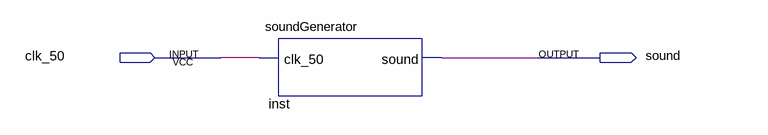
[diagram p0: schematic sheet]
// Quartus schematic soundGenerator.bdf as structural Verilog: 1 symbols, 2 pins
module soundGenerator (
  input  clk_50,
  output sound
);

  soundGenerator inst (.clk_50(clk_50), .sound(sound));
endmodule
